# Altium schematic sheet uni project 1.SchDoc
size A4; SheetNumber: 1; SheetTotal: 1
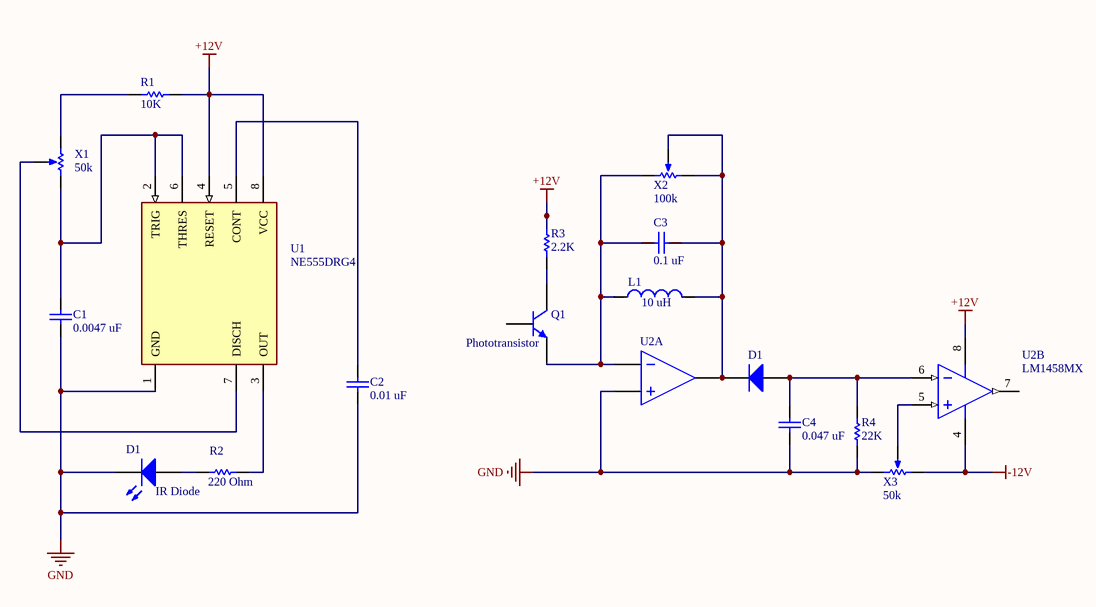
[diagram p0: uni project 1.SchDoc]

## Parts
(Parts that share a designator on the sheet are numbered #1, #2 ... from top to bottom, then left to right.)
C1  value 0.0047 uF  (hidden comment: Capacitor)
C2  value 0.01 uF  (hidden comment: Capacitor)
C3  value 0.1 uF  (hidden comment: Capacitor)
C4  value 0.047 uF  (hidden comment: Capacitor)
D1#1  Diode  (value not drawn)
D1#2  IR Diode
L1  value 10 uH  (hidden comment: Inductor)
Q1  Phototransistor
R1  value 10K  (hidden comment: Resistor)
R2  value 220 Ohm  (hidden comment: Resistor)
R3  value 2.2K  (hidden comment: Resistor)
R4  value 22K  (hidden comment: Resistor)
U1  NE555DRG4  [FP-D0008A-IPC_A]
U2  LM1458MX  [D0008A_N]  (part B of 2)
U2A  Ideal Comparator  (value not drawn)
X1  value 50k  (hidden comment: Potentiometer)
X2  value 100k  (hidden comment: Potentiometer)
X3  value 50k  (hidden comment: Potentiometer)

## Nets
+12V: R1.2 R3.2 U1.4(RESET) U1.8(VCC) U2.8(V+)
-12V: U2.4(V-) X3.1(TOP)
GND: C1.1 C2.1 C4.1 D1#2.2(K) R4.1 U1.1(GND) U2A.2(IN+) X3.2(BOT)
NetC1_2: C1.2 U1.2(TRIG) U1.6(THRES) X1.2(BOT)
NetC2_2: C2.2 U1.5(CONT)
NetC3_1: C3.1 L1.1 Q1.3(E) U2A.1(IN-) X2.2(BOT)
NetC3_2: C3.2 D1#1.2(K) L1.2 U2A.3(OUT) X2.1(TOP) X2.3(TAP)
NetC4_2: C4.2 D1#1.1(A) R4.2 U2.6(INB-)
NetD1#2_1: D1#2.1(A) R2.1
NetQ1_1: Q1.1(C) R3.1
NetR1_1: R1.1 X1.1(TOP)
NetR2_2: R2.2 U1.3(OUT)
NetU1_7: U1.7(DISCH) X1.3(TAP)
NetU2_5: U2.5(INB+) X3.3(TAP)

Not connected (* = marked no-connect by the designer): Q1 2(B); U2 7(OUTB)

## Library data of the parts
C1-C4 = Capacitor: SimulationGenericComponent: True
D1#1 = Diode: AF: 1; BV: 0; BV_MAX: 1e99; EG: 1.11; FC: 0.5; IBV: 0.001; ISR: 1e-14; MJSW: 0.33; NTUN: 30; TNOM: 27; XTI: 3; SimulationGenericComponent: True; CJO: 0; CJP: 0; CTA: 0; CTP: 0; FCS: 0.5; FV_MAX: 1e99; IKF: 0; IKR: 0; JSW: 0; JTUN: 0; JTUNSW: 0; KEG: 1; KF: 0; LEVEL: 1; N: 1; NBV: 1; NR: 1; NS: 1; PHP: 1; RS: 0; TCV: 0; TLEV: 0; TLEVC: 0; TM1: 0; TM2: 0; TPB: 0; TPHP: 0; TRS: 0; TRS2: 0; TT: 0; TTT1: 0; TTT2: 0; VJ: 1; XTITUN: 3; IS: 1e-14
D1#2 = LED: Light-Emitting Diode; AF: 1; BV: 0; BV_MAX: 1e99; EG: 1.11; FC: 0.5; IBV: 0.001; IS: 1e-14; MJSW: 0.33; NTUN: 30; TNOM: 27; XTI: 3; SimulationGenericComponent: True; CJO: 0; CJP: 0; CTA: 0; CTP: 0; FCS: 0.5; FV_MAX: 1e99; IKF: 0; IKR: 0; ISR: 1e-14; JSW: 0; JTUN: 0; JTUNSW: 0; KEG: 1; KF: 0; LEVEL: 1; N: 1; NBV: 1; NR: 1; NS: 1; PHP: 1; RS: 0; TCV: 0; TLEV: 0; TLEVC: 0; TM1: 0; TM2: 0; TPB: 0; TPHP: 0; TRS: 0; TRS2: 0; TT: 0; TTT1: 0; TTT2: 0; VJ: 1; XTITUN: 3
L1 = Inductor: SimulationGenericComponent: True
Q1 = BJT NPN_MGP: Bipolar NPN 3 Pins Transistor Modified Version of the Gummel-Poon Model; BF: 100; AF: 0; BR: 1; EG: 1.11; FC: 0.5; IS: 1e-16; MJC: 0.33; NC: 2; NE: 1.5; TNOM: 27; VBC_MAX: 1e99; VJC: 0.75; XTI: 3; SimulationGenericComponent: True; CJC: 0; CJE: 0; CJS: 0; CTC: 0; CTE: 0; CTS: 0; IKF: 0; IKR: 0; IRB: 0; ISC: 0; ISE: 0; ISS: 0; ITF: 0; KF: 0; MJE: 0.33; MJS: 0; NF: 1; NKF: 0.5; NR: 1; NS: 1; PTF: 0; RB: 0; RBM: 0; RC: 0; RE: 0; SUBS: 1; TBF1: 0; TBF2: 0; TBR1: 0; TBR2: 0; TF: 0; TIKF1: 0; TIKF2: 0; TIKR1: 0; TIKR2: 0; TIRB1: 0; TIRB2: 0; TIS1: 0; TIS2: 0; TISC1: 0; TISC2: 0; TISE1: 0; TISE2: 0; TITF1: 0; TITF2: 0; TLEV: 0; TLEVC: 0; TMJC1: 0; TMJC2: 0; TMJE1: 0; TMJE2: 0; TMJS1: 0; TMJS2: 0; TNC1: 0; TNC2: 0; TNE1: 0; TNE2: 0; TNF1: 0; TNF2: 0; TNR1: 0; TNR2: 0; TNS1: 0; TNS2: 0; TR: 0; TRB1: 0; TRB2: 0; TRC1: 0; TRC2: 0; TRE1: 0; TRE2: 0; TRM1: 0; TRM2: 0; TTF1: 0; TTF2: 0; TTR1: 0; TTR2: 0; TVAF1: 0; TVAF2: 0; TVAR1: 0; TVAR2: 0; TVJC: 0; TVJE: 0; TVJS: 0; VAF: 0; VAR: 0; VBE_MAX: 1e99; VCE_MAX: 1e99; VJE: 0.75; VJS: 0.75; VTF: 0; XCJC: 1; XTB: 0; XTF: 0
R1-R4 = Resistor: TC1: 0; SimulationGenericComponent: True; TC2: 0
U1 = CMP-04858-000027-1: IC OSC SGL TIMER 100KHZ 8-SOIC; Number of Timers/Counters: 1; Min Supply Voltage: 4.5V; Quiescent Current: 15mA; Nominal Supply Current: 2mA; Max Supply Voltage: 16V; Low Level Output Current: 200mA; Operating Supply Current: 10mA; High Level Output Current: -200mA; Height: 1.58mm; Max Operating Temperature: 70°C; Case/Package: SOIC; Package Quantity: 2500; RoHS Compliant: Yes; Min Operating Temperature: 0°C; Frequency: 100kHz; Width: 3.91mm; Mount: Surface Mount; Number of Pins: 8; Packaging: Tape and Reel; Supply Current: 2mA; Length: 4.9mm; Series: -; Weight: 0.002561oz; Radiation Hardening: No; Lead Free: Lead Free
U2 = CMP-0055-00674-3: Dual Operational Amplifier, 8-pin Narrow SOIC; Manufacturer: Texas Instruments; PackageTopMarking: NSZXTT*LM*1458M; PowerWise: N; CompType: Amplifiers; Package Reference: D0008A; Code_JEDEC: MS-012-AA; ComponentLink1Description: Datasheet URL; PinCount: 8; Code_IPC: SOIC127P600-8; ComponentLink1URL: http://www.ti.com/general/docs/lit/getliterature.tsp?genericPartNumber=LM1458&fileType=pdf; RoHS: N; PackageDescription: SOIC Narrow, 4.9 x 3.9 x 1.45mm, 8 Lead, 1.27mm Pitch
U2A = Comparator: VHIGH: 5; VLOW: 100m; VHYS: 50m; SimulationGenericComponent: True
X1-X3 = Potentiometer: position: 0.5; SimulationGenericComponent: True